# EAGLE design clock-4digits (EAGLE 5.07)
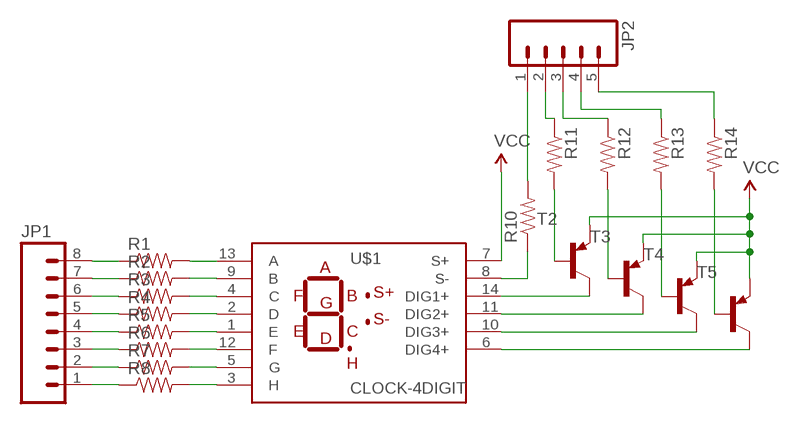
[diagram p0: schematic, sheet 1]

## Parts
JP1  M08LOCK_LONGPADS  [1X08_LOCK_LONGPADS]
JP2  M05LOCK_LONGPADS  [1X05_LOCK_LONGPADS]
R1  RESISTOR0805  [0805]
R2  RESISTOR0805  [0805]
R3  RESISTOR0805  [0805]
R4  RESISTOR0805  [0805]
R5  RESISTOR0805  [0805]
R6  RESISTOR0805  [0805]
R7  RESISTOR0805  [0805]
R8  RESISTOR0805  [0805]
R10  RESISTOR0805  [0805]
R11  RESISTOR0805  [0805]
R12  RESISTOR0805  [0805]
R13  RESISTOR0805  [0805]
R14  RESISTOR0805  [0805]
T2  90**-PNP-SOT23-BEC  [SOT23-BEC]
T3  90**-PNP-SOT23-BEC  [SOT23-BEC]
T4  90**-PNP-SOT23-BEC  [SOT23-BEC]
T5  90**-PNP-SOT23-BEC  [SOT23-BEC]
U$1  CLOCK-4DIGIT  [LG5643FH-50MMX20MM]

## Nets
N$1: R1.2 U$1.13(A)
N$2: R2.2 U$1.9(B)
N$3: R3.2 U$1.4(C)
N$4: R4.2 U$1.2(D)
N$5: R5.2 U$1.1(E)
N$6: R6.2 U$1.12(F)
N$7: R7.2 U$1.5(G)
N$8: R8.2 U$1.3(H)
N$9: R10.1 U$1.8(S-)
N$11: T2.C U$1.14(DIG1+)
N$12: T3.C U$1.11(DIG2+)
N$13: T4.C U$1.10(DIG3+)
N$14: T5.C U$1.6(DIG4+)
N$15: R11.2 T2.B
N$16: R14.2 T5.B
N$17: R13.2 T4.B
N$18: R12.2 T3.B
N$21: JP2.1 R10.2
N$22: JP2.2 R11.1
N$23: JP2.3 R12.1
N$24: JP2.4 R13.1
N$25: JP2.5 R14.1
N$26: JP1.8 R1.1
N$27: JP1.7 R2.1
N$28: JP1.6 R3.1
N$29: JP1.5 R4.1
N$30: JP1.4 R5.1
N$31: JP1.3 R6.1
N$32: JP1.2 R7.1
N$33: JP1.1 R8.1
VCC: T2.E T3.E T4.E T5.E U$1.7(S+)

## Library data of the parts
JP1 = SparkFun:M08: Header 8 Standard 8-pin 0.1" header. Use with straight break away headers (SKU : PRT-00116), right angle break away headers (PRT-00553), swiss pins (PRT-00743), machine pins (PRT-00117), and female headers (PRT-00115).
JP2 = SparkFun:M05: Header 5 Standard 5-pin 0.1" header. Use with straight break away headers (SKU : PRT-00116), right angle break away headers (PRT-00553), swiss pins (PRT-00743), machine pins (PRT-00117), and female headers (PRT-00115). Molex polarized connector foot print use with SKU : PRT-08230 with associated crimp pins and housings.
R1-R8 R10-R14 = digital-toy:RESISTOR: Resistor Basic schematic elements and footprints for 0603, 1206, and PTH 1/10th watt (small) resistors. digital-toy copy vertical mount of axial-0.3 from rcl.lbr : the 0207/xx
T2-T5 = digital-toy:*-PNP-: PNP Transistror
U$1 = led-seg:CLOCK-4DIGIT: Full CLOCK function and full 4 digits segment led(with 4 points and 2 seconds dot) Hyl 2011.1.9

## Board
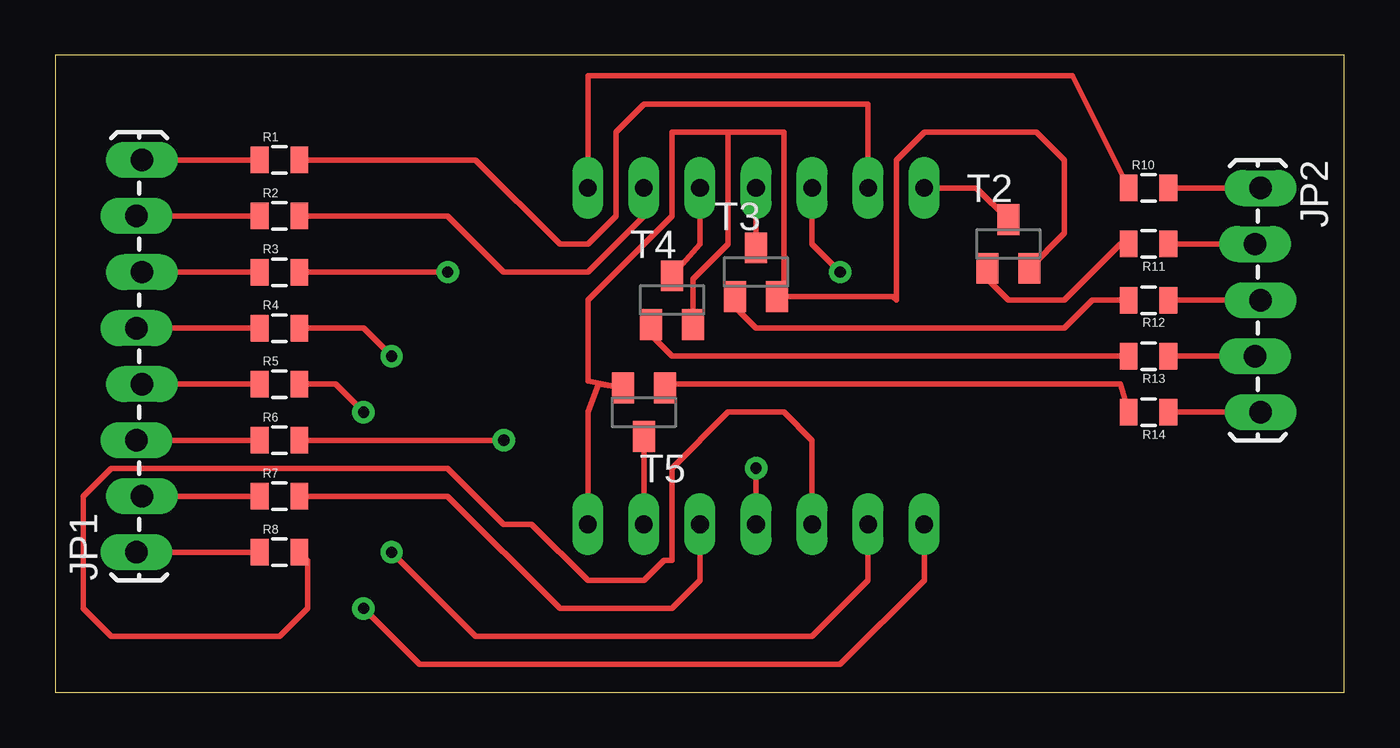
[diagram p1: board, top side]
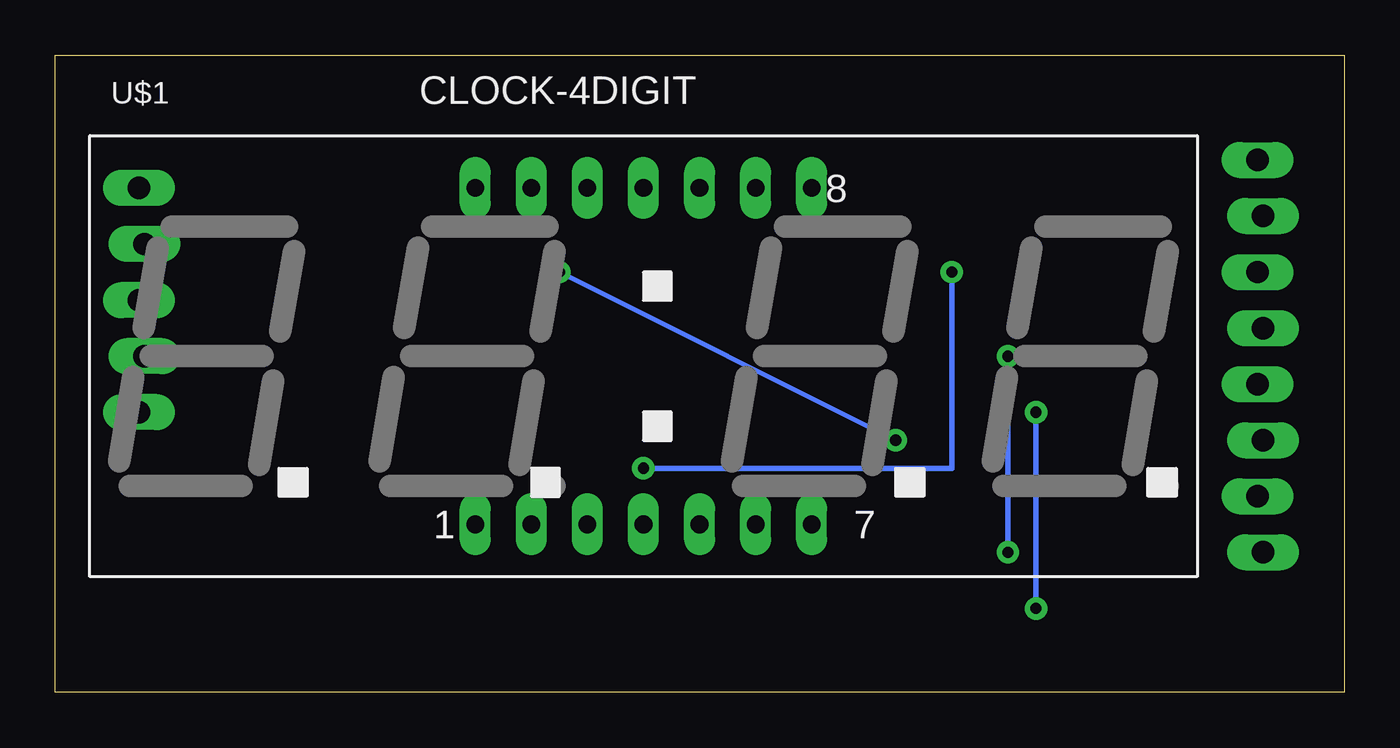
[diagram p2: board, bottom side, seen from below]

Size 58.4 x 28.88 mm. Coordinates in mm from the lower left corner, seen from the top.
Outline: 0,0 58.4,0 58.4,28.88 0,28.88 0,0
Copper layers (1*16): Top 0.035mm / dielectric 1.5mm / Bottom 0.035mm
Design rules "SparkFun": minimum track width 8mil, minimum drill 20mil, track to track 8mil, track to pad 8mil, pad to pad 8mil, via to via 8mil, smd to smd 8mil, copper to edge 10mil, drill to drill 8mil, minimum pad ring 12mil, minimum via ring 10mil, stop-mask expansion 4mil, vias tented up to drill 25mil, thermal gap 10mil

### Footprints (pad centres in the part's own frame; a part is rotated, then mirrored left to right if it is on the bottom)
1X08_LOCK_LONGPADS = drill 1.016 long: 1 0,0.127; 2 2.54,-0.127; 3 5.08,0.127; 4 7.62,-0.127; 5 10.16,0.127; 6 12.7,-0.127; 7 15.24,0.127; 8 17.78,-0.127
1X05_LOCK_LONGPADS = drill 1.016 long: 1 0,0; 2 2.54,-0.254; 3 5.08,0; 4 7.62,-0.254; 5 10.16,0
0805 = smd 0.8 x 1.2: 1 -0.9,0; 2 0.9,0
SOT23-BEC = smd 1 x 1.4: B -0.95,-1.1; C 0,1.1; E 0.95,-1.1
LG5643FH-50MMX20MM = drill 0.8 long: 1 -7.62,-7.62; 2 -5.08,-7.62; 3 -2.54,-7.62; 4 0,-7.62; 5 2.54,-7.62; 6 5.08,-7.62; 7 7.62,-7.62; 8 7.62,7.62; 9 5.08,7.62; 10 2.54,7.62; 11 0,7.62; 12 -2.54,7.62; 13 -5.08,7.62; 14 -7.62,7.62

### Placement (x,y rotation side)
JP1  3.81,6.35 90 top
JP2  54.61,22.86 270 top
R1  10.16,24.13 0 top
R2  10.16,21.59 0 top
R3  10.16,19.05 0 top
R4  10.16,16.51 0 top
R5  10.16,13.97 0 top
R6  10.16,11.43 0 top
R7  10.16,8.89 0 top
R8  10.16,6.35 0 top
R10  49.53,22.86 0 top
R11  49.53,20.32 180 top
R12  49.53,17.78 180 top
R13  49.53,15.24 180 top
R14  49.53,12.7 180 top
T2  43.18,20.32 0 top
T3  31.75,19.05 0 top
T4  27.94,17.78 0 top
T5  26.67,12.7 180 top
U$1  31.75,15.24 0 bottom

### Tracks (layer width: path | path; a pad name or v marks a point on that pad's centre or on a via)
N$1
  Top 0.254: U$1.13 36.83,26.67 26.67,26.67 25.4,25.4 25.4,21.59 24.13,20.32 22.86,20.32 19.05,24.13 R1.2
N$2
  Top 0.254: U$1.9 26.67,21.59 24.13,19.05 20.32,19.05 17.78,21.59 R2.2
N$3  (via drill 0.51)
  Top 0.254: v31.75,10.16 U$1.4 | R3.2 v17.78,19.05
  Bottom 0.254: v17.78,19.05 17.78,10.16 v31.75,10.16
N$4  (via drill 0.51)
  Top 0.254: R4.2 13.97,16.51 v15.24,15.24 | v15.24,6.35 19.05,2.54 34.29,2.54 36.83,5.08 U$1.2
  Bottom 0.254: v15.24,6.35 v15.24,15.24
N$5  (via drill 0.51)
  Top 0.254: R5.2 12.7,13.97 v13.97,12.7 | v13.97,3.81 16.51,1.27 35.56,1.27 39.37,5.08 U$1.1
  Bottom 0.254: v13.97,3.81 v13.97,12.7
N$6  (via drill 0.51)
  Top 0.254: v35.56,19.05 34.29,20.32 U$1.12 | R6.2 v20.32,11.43
  Bottom 0.254: v20.32,11.43 v35.56,19.05
N$7
  Top 0.254: R7.2 17.78,8.89 22.86,3.81 27.94,3.81 29.21,5.08 U$1.5
N$8
  Top 0.254: U$1.3 34.29,11.43 33.02,12.7 30.48,12.7 27.94,10.16 27.94,5.98 27.57,5.98 26.67,5.08 24.13,5.08 21.59,7.62 20.32,7.62 17.78,10.16 2.54,10.16 1.27,8.89 1.27,3.81 2.54,2.54 10.16,2.54 11.43,3.81 11.43,5.98 R8.2
N$9
  Top 0.254: R10.1 46.09,27.94 24.13,27.94 U$1.8
N$11
  Top 0.254: T2.C 41.74,22.86 U$1.14
N$12
  Top 0.254: T3.C U$1.11
N$13
  Top 0.254: U$1.10 29.21,20.32 T4.C
N$14
  Top 0.254: U$1.6 T5.C
N$15
  Top 0.254: R11.2 48.26,20.32 45.72,17.78 43.18,17.78 42.23,18.73 T2.B
N$16
  Top 0.254: R14.2 48.26,13.97 27.79,13.97 T5.B
N$17
  Top 0.254: R13.2 27.94,15.24 26.99,16.19 T4.B
N$18
  Top 0.254: R12.2 46.99,17.78 45.72,16.51 31.75,16.51 30.8,17.46 T3.B
N$21
  Top 0.254: R10.2 JP2.1
N$22
  Top 0.254: R11.1 JP2.2
N$23
  Top 0.254: R12.1 JP2.3
N$24
  Top 0.254: R13.1 JP2.4
N$25
  Top 0.254: R14.1 JP2.5
N$26
  Top 0.254: JP1.8 R1.1
N$27
  Top 0.254: JP1.7 R2.1
N$28
  Top 0.254: JP1.6 R3.1
N$29
  Top 0.254: JP1.5 R4.1
N$30
  Top 0.254: JP1.4 R5.1
N$31
  Top 0.254: JP1.3 R6.1
N$32
  Top 0.254: JP1.2 R7.1
N$33
  Top 0.254: JP1.1 R8.1
VCC
  Top 0.254: U$1.7 24.13,12.7 24.62,13.97 T5.E 24.13,14.12 24.13,17.78 27.94,21.59 27.94,25.4 30.48,25.4 | 30.48,25.4 30.48,20.32 28.89,18.73 T4.E | T2.E 45.72,20.81 45.72,24.13 44.45,25.4 39.37,25.4 38.1,24.13 38.1,17.78 37.93,17.95 T3.E 33.02,18.27 33.02,25.4 30.48,25.4